# EAGLE design MicrophoneSoundModule (EAGLE 6.4)
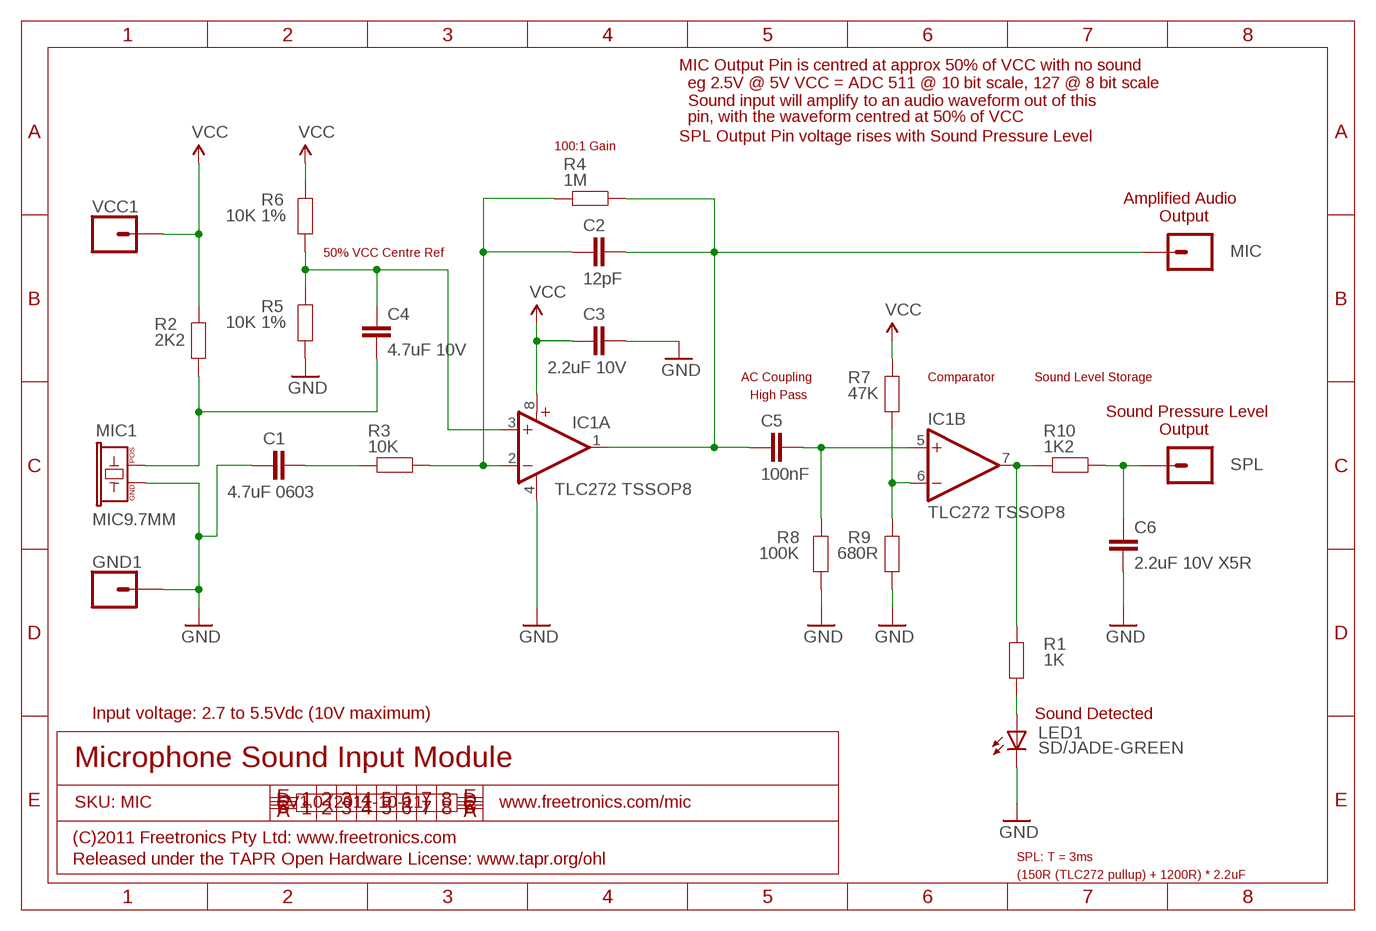
[diagram p0: schematic, sheet 1]

## Parts
C1  4.7uF 0603  CAP0603  [0603]
C2  12pF  CAP0603  [0603]
C3  2.2uF 10V  CAP0603  [0603]
C4  4.7uF 10V  CAP0603  [0603]
C5  100nF  CAP0603  [0603]
C6  2.2uF 10V X5R  CAP0603  [0603]
GND1  M01PTH  [1X01]
IC1  TLC272 TSSOP8  OPAMP-DUALTSSOP8  [TSSOP8]
LED1  SD/JADE-GREEN  LED0603  [LED-0603]
MIC  M01PTH  [1X01]
MIC1  MIC9.7MM  [MIC-9.7MM]
R1  1K  RESISTOR0603  [0603]
R2  2K2  RESISTOR0603  [0603]
R3  10K  RESISTOR0603  [0603]
R4  1M  RESISTOR0603  [0603]
R5  10K 1%  RESISTOR0603  [0603]
R6  10K 1%  RESISTOR0603  [0603]
R7  47K  RESISTOR0603  [0603]
R8  100K  RESISTOR0603  [0603]
R9  680R  RESISTOR0603  [0603]
R10  1K2  RESISTOR0603  [0603]
SPL  M01PTH  [1X01]
VCC1  M01PTH  [1X01]

## Nets
GND: C1.1 C3.2 C6.1 GND1.1 IC1.4(A:V-) LED1.C MIC1.GND R5.1 R8.1 R9.1
N$1: LED1.A R1.1
N$2: C4.1 MIC1.POS R2.1
N$3: C1.2 R3.2
N$4: C2.1 IC1.2(A:-IN) R3.1 R4.2
N$6: C2.2 C5.1 IC1.1(A:OUT) MIC.1 R4.1
N$7: C5.2 IC1.5(B:+IN) R8.2
N$8: C4.2 IC1.3(A:+IN) R5.2 R6.1
N$9: C6.2 R10.1 SPL.1
N$10: IC1.6(B:-IN) R7.1 R9.2
N$11: IC1.7(B:OUT) R1.2 R10.2
VCC: C3.1 IC1.8(A:V+) R2.2 R6.2 R7.2 VCC1.1

## Notes on the sheet
- MIC Output Pin is centred at approx 50% of VCC with no sound
- eg 2.5V @ 5V VCC = ADC 511 @ 10 bit scale, 127 @ 8 bit scale
- Sound input will amplify to an audio waveform out of this
- pin, with the waveform centred at 50% of VCC
- SPL Output Pin voltage rises with Sound Pressure Level
- 100:1 Gain
- Amplified Audio
- Output
- 50% VCC Centre Ref
- AC Coupling | Comparator | Sound Level Storage
- High Pass
- Sound Pressure Level
- Output
- Input voltage: 2.7 to 5.5Vdc (10V maximum) | Sound Detected
- Microphone Sound Input Module
- SKU: MIC | V1.0 (2011-10-11) | www.freetronics.com/mic
- (C)2011 Freetronics Pty Ltd: www.freetronics.com
- SPL: T = 3ms
- Released under the TAPR Open Hardware License: www.tapr.org/ohl
- (150R (TLC272 pullup) + 1200R) * 2.2uF

## Library data of the parts
C1-C6 = freetronics-master-v1:CAP: Capacitor Standard 0603 ceramic capacitor, and 0.1" leaded capacitor.
GND1 MIC SPL VCC1 = freetronics-master-v1:M01: Header 1 Standard 1-pin 0.1" header. Use with straight break away headers (SKU : PRT-00116), right angle break away headers (PRT-00553), swiss pins (PRT-00743), machine pins (PRT-00117), and female headers (PRT-00115).
IC1 = freetronics-master-v1:OPAMP-DUAL: Operational Amplifier
LED1 = freetronics-marc:LED: LEDs Standard schematic elements and footprints for 5mm, 3mm, 1206, and 0603 sized LEDs. 5mm - Spark Fun Electronics SKU : COM-00529 (and others)
MIC1 = freetronics-master-v1:MIC: Microphone Omni-directional electret microphone. 9.7mm standard diameter.
R1-R10 = freetronics-master-v1:RESISTOR: Resistor Basic schematic elements and footprints for 0603, 1206, and PTH 1/10th watt (small) resistors.

## Board
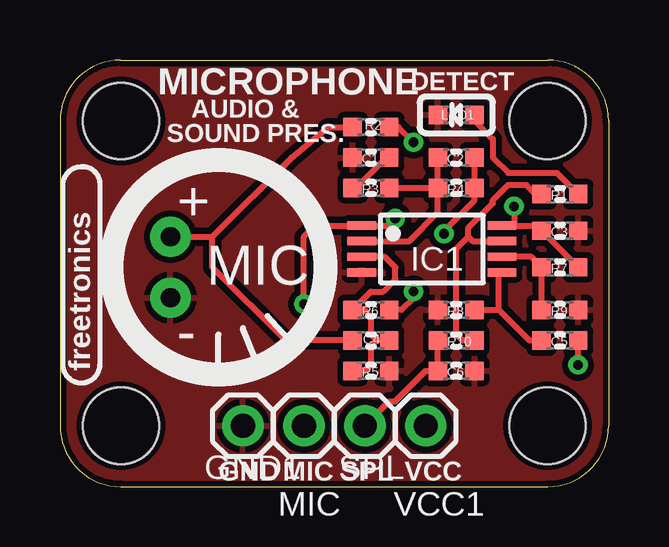
[diagram p1: board, top side]
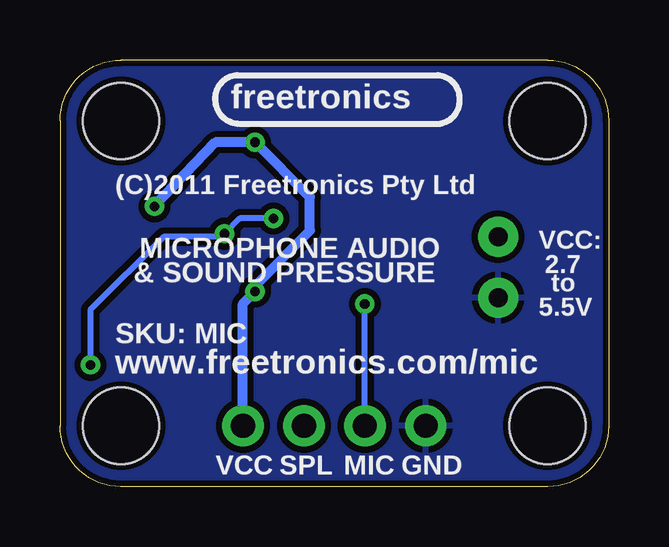
[diagram p2: board, bottom side, seen from below]

Size 22.86 x 17.78 mm. Coordinates in mm from the lower left corner, seen from the top.
Outline: 0,2.54 arc90 2.54,0 20.32,0 arc90 22.86,2.54 22.86,15.24 arc90 20.32,17.78 2.54,17.78 arc90 0,15.24 0,2.54
Copper layers (1*16): Top 0.035mm / dielectric 1.5mm / Bottom 0.035mm
Design rules "default *": minimum track width 8mil, minimum drill 15mil, track to track 10mil, track to pad 10mil, pad to pad 10mil, via to via 10mil, smd to smd 8mil, copper to edge 10mil, drill to drill 8mil, minimum pad ring 14mil, minimum via ring 8mil, stop-mask expansion 4mil, vias tented up to drill 25mil, thermal gap 10mil
Holes 3.17 mm at 2.54,2.54 20.32,2.54 2.54,15.24 20.32,15.24

### Footprints (pad centres in the part's own frame; a part is rotated, then mirrored left to right if it is on the bottom)
0603 = smd 0.762 x 0.762: 1 -0.762,0; 2 0.762,0
1X01 = drill 1.016: 1 0,0
TSSOP8 = smd 1.2 x 0.35: 1 -2.925,0.975; 2 -2.925,0.325; 3 -2.925,-0.325; 4 -2.925,-0.975; 5 2.925,-0.975; 6 2.925,-0.325; 7 2.925,0.325; 8 2.925,0.975
LED-0603 = smd 0.762 x 0.762: A -0.762,0; C 0.762,0
MIC-9.7MM = drill 0.8 pad 1.676: GND -2,-1.27; POS -2,1.27

### Placement (x,y rotation side)
C1  12.95,13.72 0 top
C2  16.51,13.72 0 top
C3  20.83,10.67 0 top
C4  12.95,6.1 0 top
C5  20.83,6.1 180 top
C6  16.51,4.83 180 top
GND1  7.62,2.54 0 top
IC1  15.49,9.91 0 top
LED1  16.51,15.49 180 top
MIC  10.16,2.54 0 top
MIC1  6.6,9.14 0 top
R1  20.83,12.19 180 top
R2  12.95,14.99 0 top
R3  12.95,12.45 180 top
R4  16.51,12.45 180 top
R5  12.95,4.83 180 top
R6  12.95,7.37 0 top
R7  20.83,9.14 0 top
R8  16.51,7.37 0 top
R9  20.83,7.37 180 top
R10  16.51,6.1 0 top
SPL  12.7,2.54 0 top
VCC1  15.24,2.54 0 top

### Tracks (layer width: path | path; a pad name or v marks a point on that pad's centre or on a via)
GND
  pour Bottom: 2.54,17.78 arc90 0,15.24 0,2.54 arc90 2.54,0 20.32,0 arc90 22.86,2.54 22.86,15.24 arc90 20.32,17.78
  pour Top: 0,15.24 0,2.54 arc90 2.54,0 20.32,0 arc90 22.86,2.54 22.86,15.24 arc90 20.32,17.78 2.54,17.78 arc90
N$1
  Top 0.254: R1.1 20.7,13.08 18.67,13.08 18.03,13.72 18.03,14.48 17.27,15.24 LED1.A
N$2
  Top 0.254: MIC1.POS 6.35,10.41 | 6.35,10.41 9.65,13.72 11.18,14.99 R2.1 | C4.1 9.4,6.1 6.35,9.14 6.35,10.41
N$3
  Top 0.254: R3.2 12.32,12.45 13.59,13.72 C1.2
N$4
  Top 0.254: R4.2 C2.1 | R4.2 R3.1 | IC1.2 14.55,10.23 15.75,11.43 R4.2
N$6  (via drill 0.4)
  Top 0.254: C2.2 R4.1 17.27,11.94 16,10.67 v16,10.54 | v13.97,11.18 13.68,10.88 IC1.1 10.63,10.88 10.16,10.41 v10.16,7.62 | v21.59,5.08 C5.1
  Bottom 0.254: v13.97,11.18 15.37,11.18 v16,10.54 16.13,10.41 18.54,10.41 21.59,7.37 v21.59,5.08 | MIC.1 v10.16,7.62
N$7
  Top 0.254: IC1.5 18.29,8.8 18.29,7.37 | R8.2 18.29,7.37 | C5.2 19.56,6.1 18.29,7.37
N$8
  Top 0.254: IC1.3 13.53,9.58 13.97,9.14 13.97,8.64 13.46,8.13 12.95,8.13 R6.1 12.7,7.37 12.95,7.11 12.95,6.35 13.21,6.1 | C4.2 13.21,6.1 | 13.21,6.1 12.95,5.84 12.95,5.08 12.7,4.83 R5.2
N$9
  Top 0.254: R10.1 C6.2 15.24,4.83 13.97,3.56 13.72,3.56 SPL.1
N$10
  Top 0.254: IC1.6 19.63,9.58 R7.1 R9.2
N$11
  Top 0.254: R1.2 19.81,12.19 19.43,12.57 18.67,12.57 18.03,11.94 18.03,11.81 17.02,10.79 17.02,10.41 | 17.02,10.41 17.2,10.23 IC1.7 | R10.2 16.76,6.1 16.51,6.35 16.51,9.91 17.02,10.41
VCC  (via drill 0.4)
  Top 0.254: 18.92,10.88 19.85,10.88 C3.1 R7.2 | 18.92,10.88 IC1.8 | v18.92,11.68 18.92,10.88 | R2.2 14.1,14.99 v14.73,14.35 | v14.73,8.13 14.73,7.87 14.22,7.37 R6.2
  Bottom 0.406: VCC1.1 15.24,7.62 v14.73,8.13 14.73,8.38 12.45,10.67 12.45,12.06 v14.73,14.35 16.38,14.35 v18.92,11.68

### Text on the board
tPlace: DETECT | MICROPHONE | AUDIO & | SOUND PRES. | freetronics | GND | MIC | SPL | VCC
bPlace: freetronics | (C)2011 Freetronics Pty Ltd | VCC: | MICROPHONE AUDIO | 2.7 | & SOUND PRESSURE | to | 5.5V | SKU: MIC | www.freetronics.com/mic | GND | MIC | SPL | VCC